# EAGLE design relais platine v6 (EAGLE 6.1)
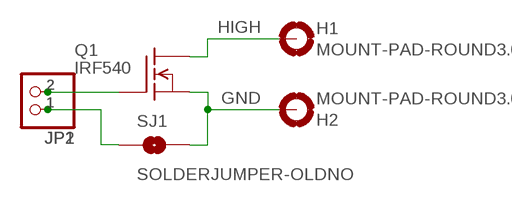
[diagram p0: schematic, sheet 1]

## Parts
H1  MOUNT-PAD-ROUND3.0  [3,0-PAD]
H2  MOUNT-PAD-ROUND3.0  [3,0-PAD]
JP1  PINHD-1X2  [1X02]
JP2  PINHD-1X2/90  [1X02/90]
Q1  IRF540  [TO220]
SJ1  SOLDERJUMPER-OLDNO  [SJ_2S-NO]

## Nets
GND: H2.B3,0(MOUNT) Q1.3(S) SJ1.2
HIGH: H1.B3,0(MOUNT) Q1.2(D)
N$1: JP1.1 JP2.1 SJ1.1
N$2: JP1.2 JP2.2 Q1.1(G)

## Library data of the parts
H1 H2 = holes:MOUNT-PAD-ROUND: MOUNTING PAD, round
JP1 JP2 = pinhead:PINHD-1X2: PIN HEADER
Q1 = transistor-fet:IRF540: N-Channel Enhancement MOSFET (HEXFET); 100V; 28A; 0,077Ohm
SJ1 = SparkFun-Retired:SOLDERJUMPER-OLD: Solder Jumper Standard SMD solder jumper. Used to automate production. Two varients : Normally Open and Normally Closed are the same, but have different paste layers. NC will have a large amount of paste and should jumper during reflow.

## Board
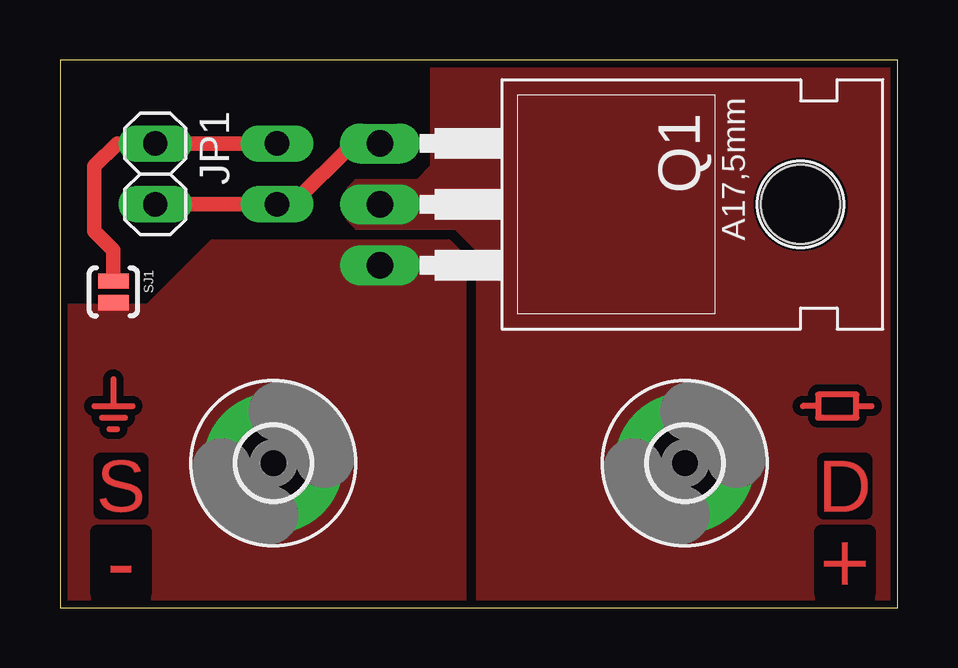
[diagram p1: board, top side]
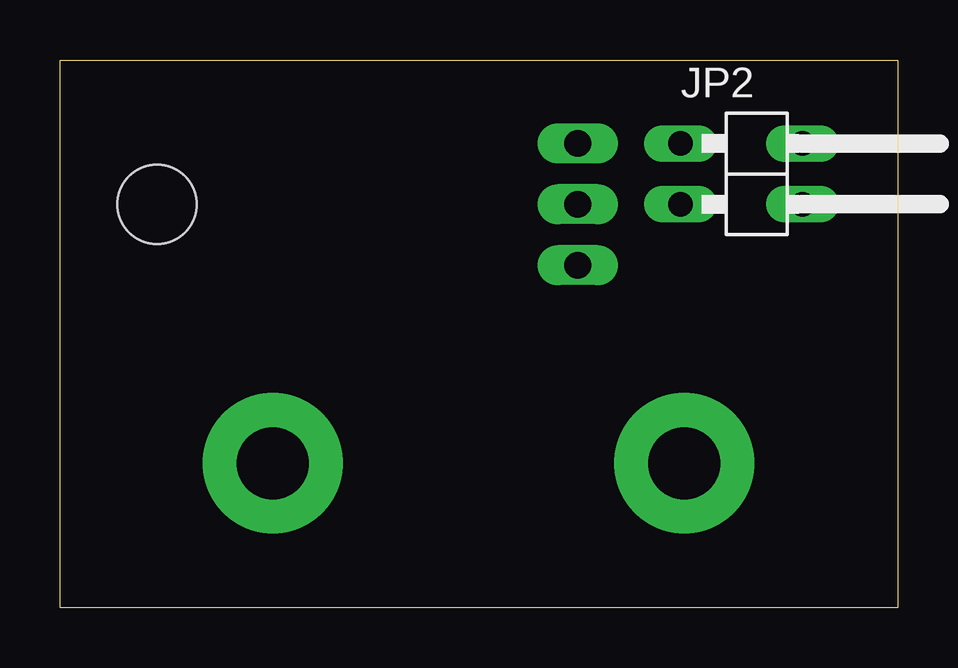
[diagram p2: board, bottom side, seen from below]

Size 34.91 x 22.85 mm. Coordinates in mm from the lower left corner, seen from the top.
Outline: 0,0 34.91,0 34.91,22.85 0,22.85 0,0
Copper layers (1*16): Top 0.035mm / dielectric 1.5mm / Bottom 0.035mm
Design rules: minimum track width 10mil, minimum drill 24mil, track to track 12mil, track to pad 12mil, pad to pad 12mil, via to via 12mil, smd to smd 10mil, copper to edge 12mil, drill to drill 12mil, minimum pad ring 10mil, minimum via ring 10mil, stop-mask expansion 4mil, vias tented up to drill 0mil, thermal gap 12mil

### Footprints (pad centres in the part's own frame; a part is rotated, then mirrored left to right if it is on the bottom)
3,0-PAD = drill 3 pad 5.842: B3,0 0,0
1X02 = drill 1.016 long: 1 -1.27,0; 2 1.27,0
1X02/90 = drill 1.016 long: 1 -1.27,-3.81; 2 1.27,-3.81
TO220 = drill 1.118 long: 1 -2.54,-6.35; 2 0,-6.35; 3 2.54,-6.35 | hole 3.302: 0,11.176
SJ_2S-NO = smd 0.635 x 1.27: 1 -0.45,0; 2 0.45,0

### Placement (x,y rotation side)
H1  26.04,6.03 0 top
H2  8.89,6.03 0 top
JP1  3.97,18.1 270 top
JP2  5.24,18.1 270 bottom
Q1  19.68,16.83 270 top
SJ1  2.22,13.18 270 top

### Tracks (layer width: path | path; a pad name or v marks a point on that pad's centre or on a via)
GND
  pour Top (no thermals): 16.19,15.24 6.35,15.24 3.65,12.54 0,12.54 0,0 16.83,0 16.83,14.61
HIGH
  pour Top (no thermals): 17.46,0 17.46,14.92 16.51,15.88 12.38,15.88 12.06,16.19 12.06,17.46 12.38,17.78 14.92,17.78 15.56,18.41 15.56,22.86 34.92,22.86 34.92,0
N$1
  Top 0.61: SJ1.1 2.22,14.92 1.43,15.72 1.43,18.41 2.38,19.37 JP1.1 JP2.1
N$2
  Top 0.61: JP1.2 JP2.2 9.68,16.83 12.22,19.37 Q1.1
N$3
  Top 0.254: 2.22,9.52 2.22,8.41
N$4
  Top 0.254: 1.43,8.41 3.02,8.41
N$5
  Top 0.254: 1.75,7.94 2.7,7.94
N$6
  Top 0.254: 2.06,7.46 2.38,7.46
N$7
  Top 0.254: 33.18,8.41 33.18,7.94 31.59,7.94 31.59,8.41 | 33.18,8.41 33.18,8.89 31.59,8.89 31.59,8.41 | 31.59,8.41 30.96,8.41 | 33.18,8.41 33.81,8.41

### Text on the board
Top: S | D | - | +